# Altium schematic sheet Transformer.SchDoc: Transformer
size A3; SheetNumber: 3; SheetTotal: 3
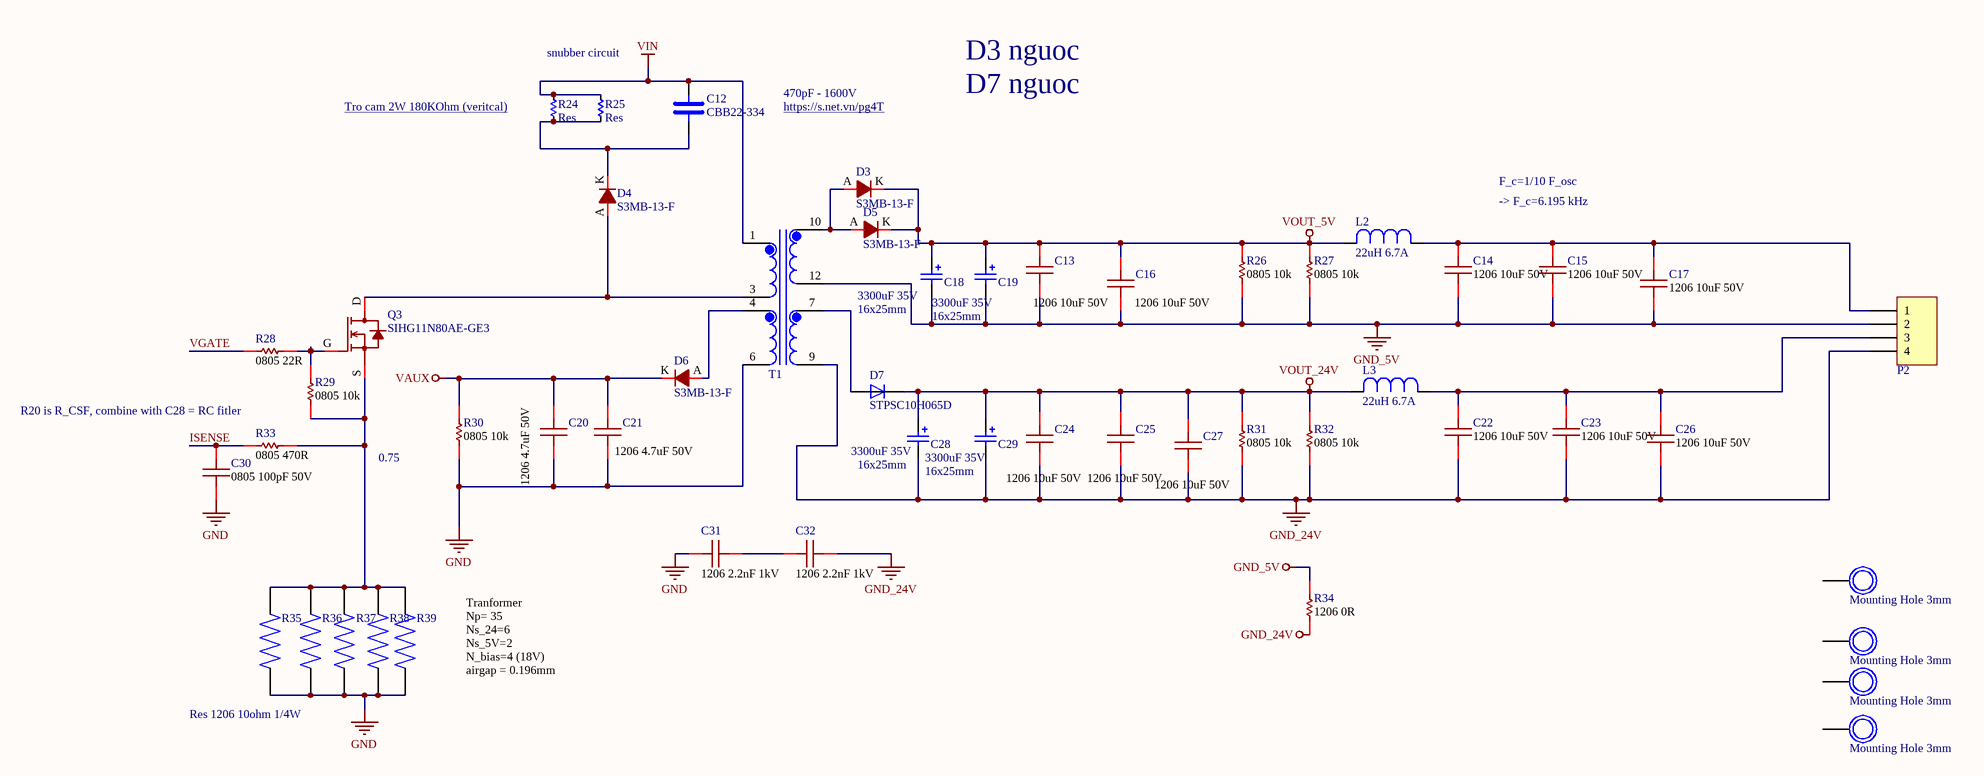
[diagram p0: Transformer.SchDoc]

## Parts
C12  CBB22-334  [Cap 1600v]
C13  value 1206 10uF 50V  [Cap 1206]  (hidden comment: C3216X7R1H475M160AC)
C14  value 1206 10uF 50V  [Cap 1206]  (hidden comment: C3216X7R1H475M160AC)
C15  value 1206 10uF 50V  [Cap 1206]  (hidden comment: C3216X7R1H475M160AC)
C16  value 1206 10uF 50V  [Cap 1206]  (hidden comment: C3216X7R1H475M160AC)
C17  value 1206 10uF 50V  [Cap 1206]  (hidden comment: C3216X7R1H475M160AC)
C18  2700uF  [WCAP-ATG8_D16H25]  (value not drawn)
C19  2700uF  [WCAP-ATG8_D16H25]  (value not drawn)
C20  value 1206 4.7uF 50V  [Cap 1206]  (hidden comment: C3216X7R1H475M160AC)
C21  value 1206 4.7uF 50V  [Cap 1206]  (hidden comment: C3216X7R1H475M160AC)
C22  value 1206 10uF 50V  [Cap 1206]  (hidden comment: C3216X7R1H475M160AC)
C23  value 1206 10uF 50V  [Cap 1206]  (hidden comment: C3216X7R1H475M160AC)
C24  value 1206 10uF 50V  [Cap 1206]  (hidden comment: C3216X7R1H475M160AC)
C25  value 1206 10uF 50V  [Cap 1206]  (hidden comment: C3216X7R1H475M160AC)
C26  value 1206 10uF 50V  [Cap 1206]  (hidden comment: C3216X7R1H475M160AC)
C27  value 1206 10uF 50V  [Cap 1206]  (hidden comment: C3216X7R1H475M160AC)
C28  2700uF  [WCAP-ATG8_D16H25]  (value not drawn)
C29  2700uF  [WCAP-ATG8_D16H25]  (value not drawn)
C30  Parameter 1: 0805 100pF 50V  [CAP 0805]  (hidden comment: C0805C101J5RACTU)
C31  value 1206 2.2nF 1kV  [Cap 1206]  (hidden comment: CC1206KKX7RCBB222)
C32  value 1206 2.2nF 1kV  [Cap 1206]  (hidden comment: CC1206KKX7RCBB222)
D3  S3MB-13-F  [DIODE 1kV 3A]
D4  S3MB-13-F  [DIODE 1kV 3A]
D5  S3MB-13-F  [DIODE 1kV 3A]
D6  S3MB-13-F  [DIODE 1kV 3A]
D7  STPSC10H065D  [TO508P1016X470X2286-2]
H1  Mounting Hole 3mm  [3mm with via]
H2  Mounting Hole 3mm  [3mm with via]
H3  Mounting Hole 3mm  [3mm with via]
H4  Mounting Hole 3mm  [3mm with via]
L2  22uH 6.7A  [IND_CDRH127/LDNP-470MC_SUM]
L3  22uH 6.7A  [IND_CDRH127/LDNP-470MC_SUM]
P2  Domino 4  [DOMINO 4 -5mm]  (value not drawn)
Q3  SIHG11N80AE-GE3  [N-CH MOSFET 1k2V]
R24  Res  [RES-1WD]
R25  Res  [RES-1WD]
R26  value 0805 10k  [RES 0805]  (hidden comment: RC0805FR-1310KL)
R27  value 0805 10k  [RES 0805]  (hidden comment: RC0805FR-1310KL)
R28  value 0805 22R  [RES 0805]  (hidden comment: RC0805FR-0722RP)
R29  value 0805 10k  [RES 0805]  (hidden comment: RC0805FR-1310KL)
R30  value 0805 10k  [RES 0805]  (hidden comment: RC0805FR-1310KL)
R31  value 0805 10k  [RES 0805]  (hidden comment: RC0805FR-1310KL)
R32  value 0805 10k  [RES 0805]  (hidden comment: RC0805FR-1310KL)
R33  value 0805 470R  [RES 0805]  (hidden comment: RC0805FR-07470RP)
R34  value 1206 0R  [RES 1206]  (hidden comment: RES_1206_0R)
R35  RC1206JR-0713RL  [RESC3116X65N]  (value not drawn)
R36  RC1206JR-0713RL  [RESC3116X65N]  (value not drawn)
R37  RC1206JR-0713RL  [RESC3116X65N]  (value not drawn)
R38  RC1206JR-0713RL  [RESC3116X65N]  (value not drawn)
R39  RC1206JR-0713RL  [RESC3116X65N]  (value not drawn)
T1  PQ35  [CPV-PQ3535-1S-12P-Z_FXC]  (value not drawn)

## Nets
GND: C20.2 C21.2 C30.2 C31.1 R30.1 R35.1 R36.1 R37.1 R38.1 R39.1 T1.6
GND_5V: C13.2 C14.2 C15.2 C16.2 C17.2 C18.2(N) C19.2(N) P2.2 R26.1 R27.1 R34.2 T1.12
GND_24V: C22.2 C23.2 C24.2 C25.2 C26.2 C27.2 C28.2(N) C29.2(N) C32.2 P2.4 R31.1 R32.1 R34.1 T1.9
VAUX: C20.1 C21.1 D6.K R30.2
VIN: C12.2 R24.1 R25.1 T1.1
VOUT_5V: C13.1 C16.1 C18.1(P) C19.1(P) D3.K D5.K L2.2 R26.2 R27.2
VOUT_24V: C24.1 C25.1 C27.1 C28.1(P) C29.1(P) D7.1(C) L3.2 R31.2 R32.2
ISENSE: C30.1 R33.1
VGATE: R28.1
NetC12_1: C12.1 D4.K R24.2 R25.2
NetC14_1: C14.1 C15.1 C17.1 L2.1 P2.1
NetC22_1: C22.1 C23.1 C26.1 L3.1 P2.3
NetC31_2: C31.2 C32.1
NetD3_A: D3.A D5.A T1.10
NetD4_A: D4.A Q3.D T1.3
NetD6_A: D6.A T1.4
NetD7_2: D7.2(A) T1.7
NetQ3_G: Q3.G R28.2 R29.2
NetQ3_S: Q3.S R29.1 R33.2 R35.2 R36.2 R37.2 R38.2 R39.2

Not connected (* = marked no-connect by the designer): H1 0; H2 0; H3 0; H4 0

## Notes on the sheet
- snubber circuit
- (near R24) Tro cam 2W 180KOhm (veritcal) <https://icdayroi.com/dien-tro-180k-2w>
- 470pF - 1600V
- https://s.net.vn/pg4T
- D3 nguoc
- D7 nguoc
- F_c=1/10 F_osc
- -> F_c=6.195 kHz
- (near C18) 3300uF 35V
- (near C18) 16x25mm
- 3300uF 35V
- 16x25mm
- R20 is R_CSF, combine with C28 = RC fitler
- 0.75
- (near C28) 3300uF 35V
- (near C28) 16x25mm
- Res 1206 10ohm 1/4W
- Tranformer
  Np= 35
  Ns_24=6
  Ns_5V=2
  N_bias=4 (18V)
  airgap = 0.196mm
- Project:
- XEVTECH COMPANY LIMITED
- Address: C17, Khu Barya City
- Drawn by:
- Size:
- A3
- Sheet
- of
- Date:
- TP Bà Rịa, Tỉnh Bà Rịa Vũng Tàu
- Email: admin@xevtech.vn
- Phone: 090 172 8898

## Library data of the parts
C12 = CBB22-334: CBB 630V 472J (4.7NF) 15mm; Dielectric: Metallized Polypropylene; Capacitant: 47nF; Max RMS voltage: 630V; Supply link: https://chipn24.com/g54-tu-cbb-630v-472j-p10mm-472-4-7nf-id4742.html
C13-C17 C20-C27 = Cap 1206 4.7uF: 4.7 µF ±20% 50V Ceramic Capacitor X7R 1206 (3216 Metric); Manufacturer 1: TDK; Manufacturer Part Number 1: CGA5L1X7R1V106M160AC; Description 1: Cap Ceramic 10uF 35V X7R 20% SMD 1206 125°C Blister Plastic T/R; Category 1: Ceramic Capacitors; Capacitance: 10uF; Voltage Rating: 35V; RoHS 1: Yes; Stock 1: 4126; Pricing 1: 1=0,72, 10=0,53, 50=0,4242, 100=0,3636, 500=0,28784, 1000=0,2424 (USD); Mount: Surface Mount; Case/Package: 1206; Case Code (Imperial): 1206; Case Code (Metric): 3216; Weight: 0.000571oz; Min Operating Temperature: -55°C; Max Operating Temperature: 125°C; Packaging: Tape and Reel; Tolerance: 20%; Dielectric: X7R; Termination: SMD/SMT; Voltage Rating (DC): 35V; Package Quantity: 2000; Series: CGA; Length: 0.126inch; Width: 1.6mm; Height: 1.6mm; Thickness: 0.071inch; Ratings: AEC-Q200; RoHS Compliant: Yes; ComponentLink1URL: https://product.tdk.com/info/en/catalog/datasheets/mlcc_automotive_general_en.pdf?src-supplier=Digi-Key; ComponentLink1Description: https://product.tdk.com/info/en/catalog/datasheets/mlcc_automotive_general_en.pdf?src-supplier=Digi-Key; ComponentLink2URL: http://product.tdk.com/capacitor/mlcc/detailed_information.php?lang=en&ref=jp&part_no=CGA5L1X7R1V106M160AC&src-supplier=Mouser; ComponentLink2Description: http://product.tdk.com/capacitor/mlcc/detailed_information.php?lang=en&ref=jp&part_no=CGA5L1X7R1V106M160AC&src-supplier=Mouser; ComponentLink3URL: http://product.tdk.com/capacitor/mlcc/class/print_detail_pdf.php?lang=en&part_no=CGA5L1X7R1V106M160AC&src-supplier=Avnet; ComponentLink3Description: http://product.tdk.com/capacitor/mlcc/class/print_detail_pdf.php?lang=en&part_no=CGA5L1X7R1V106M160AC&src-supplier=Avnet; ComponentLink4URL: https://product.tdk.com/info/en/catalog/spec/mlccspec_automotive_general_midvoltage_en.pdf?src-supplier=Digi-Key; ComponentLink4Description: https://product.tdk.com/info/en/catalog/spec/mlccspec_automotive_general_midvoltage_en.pdf?src-supplier=Digi-Key; Supplier 1: Digikey; Supplier Part Number 1: 445-8033-1-ND
C18 C19 C28 C29 = 860010480022: WCAP-ATG8 Aluminum Electrolytic Capacitor, Radial THT, D16xH25mm, 2700uF, 25V; Manufacturer: Wurth Elektronik; Capacitance Tolerance: +/-20%; Dissipation Factor: 14%; Endurance: 2000h; Leakage Current: 675uA; Ripple Current: 1804mA; Technical Reference: ATBK250272M025DSPAEB000; ComponentLink1Description: Manufacturer Link; ComponentLink1URL: https://www.we-online.com/redexpert/article/860010480022?ad; ComponentLink2Description: Datasheet; ComponentLink2URL: https://www.we-online.com/redexpert/spec/860010480022?ad; Category: Aluminum Electrolytic Capacitors; Match Code: WCAP-ATG8; Manufacturer Part Number: 860010480022; Mount: Through Hole; Operating Temperature Max: 85°C; Operating Temperature Min: -40°C; Packaging: Ammo Pack; Height: 25mm; Diameter: 16mm; Capacitance: 2700uF; Rated Voltage (DC): 25V
C30 = CAP 0805 100pF: CAP, CERM, 100 pF, 50 V, +/- 5%, X7R, 0805; Manufacturer 1: KEMET; Description 1: Cap Ceramic 100pF 50V X7R 5% SMD 0805 125C Paper T/R; Category 1: Ceramic Capacitors; Supplier 1: Mouser; Supplier Part Number 1: 80-C0805C101J5R; Manufacturer Part Number 1: C0805C101J5RACTU; RoHS 1: Yes; Stock 1: 27580; Pricing 1: 1=0,14, 10=0,059, 50=0,059, 100=0,034, 1000=0,027, 10000=0,022 (USD); ComponentLink1URL: http://components.arrow.com/part/dataview/42933017S9108484N7429?src-supplier=Arrow+Electronics; ComponentLink1Description: http://components.arrow.com/part/dataview/42933017S9108484N7429?src-supplier=Arrow+Electronics; ComponentLink2URL: https://datasheet.octopart.com/C0805C101J5RACTU-KEMET-datasheet-157246124.pdf?src-supplier=TME; ComponentLink2Description: https://datasheet.octopart.com/C0805C101J5RACTU-KEMET-datasheet-157246124.pdf?src-supplier=TME
C31 C32 = Cap 1206 2.2nF: 2200 pF ±10% 1000V (1kV) Ceramic Capacitor X7R 1206 (3216 Metric); Manufacturer 1: Yageo; Description 1: Multilayer Ceramic Capacitor, 2200 pF, 1000 V, ± 10%, X7R, 1206 [3216 Metric]; Category 1: Ceramic Capacitors; Material: 4241ConductorMaterial; Supplier 1: Digikey; Manufacturer Part Number 1: CC1206KKX7RCBB222; RoHS 1: Yes; Stock 1: 424375; Pricing 1: 1=0,18, 10=0,119, 50=0,0754, 100=0,0603, 500=0,04358, 1000=0,03856 (USD); Voltage Rating (AC): 1kV; ComponentLink1URL: https://datasheet.ciiva.com/11787/0900766b80d8503a-11787843.pdf?src-supplier=Rs; ComponentLink1Description: https://datasheet.ciiva.com/11787/0900766b80d8503a-11787843.pdf?src-supplier=Rs; ComponentLink2URL: https://datasheet.ciiva.com/13264/upy-gp-np0-16v-to-50v-8-3714-13264204.pdf?src-supplier=Mouser; ComponentLink2Description: https://datasheet.ciiva.com/13264/upy-gp-np0-16v-to-50v-8-3714-13264204.pdf?src-supplier=Mouser; ComponentLink3URL: https://datasheet.ciiva.com/190/mlccorderingcode-190678.pdf?src-supplier=Digikey; ComponentLink3Description: https://datasheet.ciiva.com/190/mlccorderingcode-190678.pdf?src-supplier=Digikey; ComponentLink4URL: https://datasheet.ciiva.com/190/mlccorderingcode-190679.pdf?src-supplier=Digikey; ComponentLink4Description: https://datasheet.ciiva.com/190/mlccorderingcode-190679.pdf?src-supplier=Digikey; ComponentLink5URL: https://datasheet.ciiva.com/190/mlccorderingcode-190680.pdf?src-supplier=Digikey; ComponentLink5Description: https://datasheet.ciiva.com/190/mlccorderingcode-190680.pdf?src-supplier=Digikey; Supplier Part Number 1: 311-1511-1-ND
D3-D6 = DIODE 1000V 3A: DIODE GEN PURP 1KV 3A SMB; Manufacturer: Diodes Inc.; Peak Reverse Current: 10uA; Max Junction Temp: +150°C; Reverse Voltage: 1000V; Standoff Height: 0.05mm; Max Surge Forward Current: 100A; Capacitance: 40pF; Value: 40pF; Automotive: No; Device Class L1: Discrete Semiconductors; ComponentLink2Description: Datasheet; Temperature Range Low: -65°C; Lead Free: Yes; Height: 2.5mm; Device Class L3: Rectifier Diodes; Footprint Url: https://www.diodes.com/assets/Package-Files/SMB.pdf; Device Class L2: Diodes; Octopart: https://octopart.com/s3mb-13-f-diodes+inc.-333387; Temperature: -65°C to +150°C; ComponentLink2URL: https://www.diodes.com/assets/Datasheets/ds16005.pdf; RoHS: TRUE; Max Repetitive Reverse Voltage: 1000V; Package: SMB; Digikey Description: DIODE GEN PURP 1KV 3A SMB; Category: Diode; Manufacturer Part Number: S3MB-13-F; Forward Current: 3A; Mouser Description: Rectifiers 1000V 3A; Temperature Range High: +150°C; Supplier 1: Digikey; Supplier Part Number 1: S3MB-FDICT-ND
L2 L3 = CDRH127/LDNP-470MC: 47 ÂµH Shielded - Inductor 3.25 A 78mOhm Max Nonstandard; MF: Sumida America; SnapEDA_Link: https://www.snapeda.com/parts/CDRH127/LDNP-470MC/Sumida+America+Components+Inc./view-part/?ref=snap; MP: CDRH127/LDNP-470MC; Availability: In Stock; Price: None; Value: *; Check_prices: https://www.snapeda.com/parts/CDRH127/LDNP-470MC/Sumida+America+Components+Inc./view-part/?ref=eda; Package: Nonstandard Sumida; Purchase-URL: https://pricing.snapeda.com/search/part/CDRH127/LDNP-470MC/?ref=eda
P2 = Domino 4: Domino 4-Pin; LatestRevisionDate: 17-Jul-2002; LatestRevisionNote: Re-released for DXP Platform.; Publisher: Altium Limited
Q3 = SIHG11N80AE-GE3: MOSFET N-CH 800V 8A TO247AC; Manufacturer_Name: onsemi; Manufacturer_Part_Number: NVHL160N120SC1; Datasheet Link: https://www.onsemi.com/pdf/datasheet/nvhl160n120sc1-d.pdf; Height: 4.82mm; Mouser Part Number: 863-NVHL160N120SC1; Mouser Price/Stock: https://www.mouser.co.uk/ProductDetail/ON-Semiconductor/NVHL160N120SC1?qs=GedFDFLaBXGyNe%2F0JxjRIw%3D%3D; Arrow Part Number: NVHL160N120SC1; Arrow Price/Stock: https://www.arrow.com/en/products/nvhl160n120sc1/on-semiconductor; Supplier 1: Digikey; Supplier Part Number 1: 742-SIHG11N80AE-GE3-ND
R24 R25 = Res: Manufacturer: Generic Components; Class: Passive; SubClass: R; Published: 08/06/2000; Publisher: Altium Hobart Technology Centre
R26 R27 R29-R32 = RES_0805_10k: 10 kOhms ±1% 0.125W, 1/8W Chip Resistor 0805 (2012 Metric) Moisture Resistant Thick Film; Supplier 1: Digi-Key; Supplier Part Number 1: 13-RC0805FR-1310KLDKR-ND
R28 = RES_0805_22R: 22 Ohms ±1% 0.125W, 1/8W Chip Resistor 0805 (2012 Metric) Automotive AEC-Q200, Moisture Resistant Thick Film; Manufacturer 1: Yageo; Manufacturer Part Number 1: AC0805FR-0733RL; Description 1: SMD Chip Resistor, 33 Ohm, ± 1%, 125 mW, 0805 [2012 Metric], Thick Film, General Purpose; Category 1: Chip SMD Resistors; Supplier 1: Digikey; RoHS 1: Yes; Stock 1: 24620; Pricing 1: 1=0,1, 10=0,029, 50=0,0188, 100=0,0158, 500=0,01096, 1000=0,00948 (USD); ComponentLink1URL: http://www.mouser.com/ds/2/447/yageodocoutput-1111992.pdf?src-supplier=Mouser; ComponentLink1Description: http://www.mouser.com/ds/2/447/yageodocoutput-1111992.pdf?src-supplier=Mouser; ComponentLink2URL: http://www.yageo.com/NewPortal/yageodocoutput?fileName=/pdf/R-Chip/PYu-AC_51_RoHS_L_6.pdf&src-supplier=Digi-Key; ComponentLink2Description: http://www.yageo.com/NewPortal/yageodocoutput?fileName=/pdf/R-Chip/PYu-AC_51_RoHS_L_6.pdf&src-supplier=Digi-Key; ComponentLink3URL: https://www.yageo.com/upload/media/product/productsearch/datasheet/rchip/PYu-AC_51_RoHS_L_7.pdf?src-supplier=Digi-Key; ComponentLink3Description: https://www.yageo.com/upload/media/product/productsearch/datasheet/rchip/PYu-AC_51_RoHS_L_7.pdf?src-supplier=Digi-Key; ComponentLink4URL: http://www.yageo.com/NewPortal/yageodocoutput?fileName=/pdf/R-Chip/PYu-AC_51_RoHS_L_5.pdf&src-supplier=Digi-Key; ComponentLink4Description: http://www.yageo.com/NewPortal/yageodocoutput?fileName=/pdf/R-Chip/PYu-AC_51_RoHS_L_5.pdf&src-supplier=Digi-Key; ComponentLink5URL: https://datasheet.octopart.com/AC0805FR-0733RL-Yageo-datasheet-151884373.pdf?src-supplier=Future+Electronics; ComponentLink5Description: https://datasheet.octopart.com/AC0805FR-0733RL-Yageo-datasheet-151884373.pdf?src-supplier=Future+Electronics; Supplier Part Number 1: 13-RC0805FR-0722RPCT-ND
R33 = RES_0805_470: 470 Ohms ±1% 0.125W, 1/8W Chip Resistor 0805 (2012 Metric) Moisture Resistant Thick Film; Supplier 1: Digikey; Supplier Part Number 1: 13-RC0805FR-07470RPCT-ND
R34 = RES_1206_0R: 0 Ohms ±5% 1W, Moisture Resistant Thick Film; Manufacturer_Name: Bourns; Manufacturer_Part_Number: CR1206-F/-2R00ELF; Height: 0.75mm; Mouser Part Number: 652-CR1206-F/2R00ELF; Mouser Price/Stock: https://www.mouser.co.uk/ProductDetail/Bourns/CR1206-F-2R00ELF?qs=W%2FMpXkg%252BdQ47Z%2FeZv1nDSg%3D%3D; Supplier 1: Digikey; Supplier Part Number 1: 541-4322-1-ND
R35-R39 = RC1206JR-0713RL: 13 Ohms Â±5% 0.25W, 1/4W Chip Resistor 1206 (3216 Metric) Moisture Resistant Thick Film; MF: Yageo; Check_prices: https://www.snapeda.com/parts/RC1206JR-0713RL/Yageo/view-part/?ref=eda; Value: *; Availability: In Stock; MP: RC1206JR-0713RL; Price: None; Package: 3116 Yageo; SnapEDA_Link: https://www.snapeda.com/parts/RC1206JR-0713RL/Yageo/view-part/?ref=snap; Purchase-URL: https://pricing.snapeda.com/search/part/RC1206JR-0713RL/?ref=eda
T1 = PQ35: Main Tranformer with 2 output line